# EAGLE schematic Power-Supply (EAGLE 9.6.2)
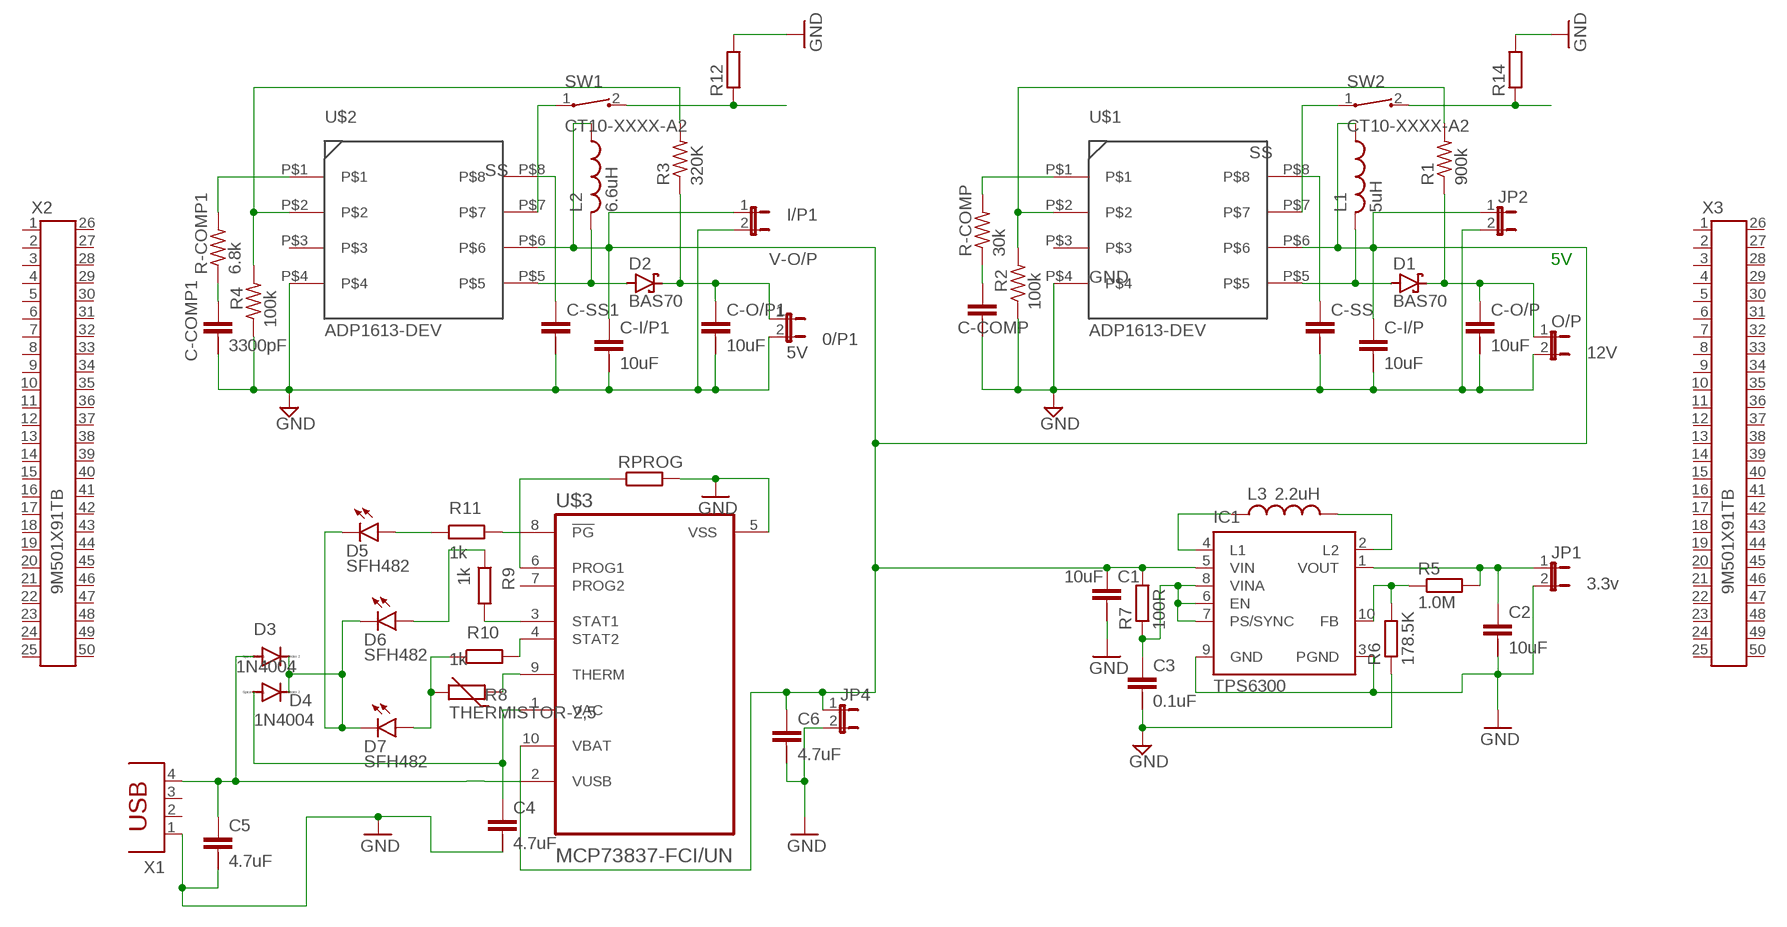
[diagram p0: schematic, sheet 1]

## Parts
0/P1  5V  JP1E  [JP1]
C1  10uF  C-2.5-5/2  [C2.5/5-2]
C2  10uF  C-2.5-5/2  [C2.5/5-2]
C3  0.1uF  C-2.5-5/2  [C2.5/5-2]
C4  4.7uF  C-2.5-5/2  [C2.5/5-2]
C5  4.7uF  C-2.5-5/2  [C2.5/5-2]
C6  4.7uF  C-2.5-5/2  [C2.5/5-2]
C-COMP  C-2.5-5/2  [C2.5/5-2]
C-COMP1  3300pF  C-2.5-5/2  [C2.5/5-2]
C-I/P  10uF  C-2.5-5/2  [C2.5/5-2]
C-I/P1  10uF  C-2.5-5/2  [C2.5/5-2]
C-O/P  10uF  C-2.5-5/2  [C2.5/5-2]
C-O/P1  10uF  C-2.5-5/2  [C2.5/5-2]
C-SS  C-2.5-5/2  [C2.5/5-2]
C-SS1  C-2.5-5/2  [C2.5/5-2]
D1  BAS70  [SOT23]
D2  BAS70  [SOT23]
D3  1N4004  [DO41-10]
D4  1N4004  [DO41-10]
D5  SFH482  [SFH482]
D6  SFH482  [SFH482]
D7  SFH482  [SFH482]
I/P1  3.3V  JP1E  [JP1]
IC1  TPS6300  [DRC-S-PVSON-N10]
JP1  3.3v  JP1E  [JP1]
JP2  JP1E  [JP1]
JP4  JP1E  [JP1]
L1  5uH  L-US0204/5  [0204/5]
L2  6.6uH  L-US0204/5  [0204/5]
L3  2.2uH  L-US0204/5  [0204/5]
O/P  12V  JP1E  [JP1]
R1  900k  R-US_0204/2V  [0204V]
R2  100k  R-US_0204/2V  [0204V]
R3  320K  R-US_0204/2V  [0204V]
R4  100k  R-US_0204/2V  [0204V]
R5  1.0M  R-EU_0204/5  [0204/5]
R6  178.5K  R-EU_0204/5  [0204/5]
R7  100R  R-EU_0204/5  [0204/5]
R8  THERMISTOR-2,5  [RS-2,5]
R9  1k  R  (no package)
R10  1k  R  (no package)
R11  1k  R  (no package)
R12  R-EU_0204/2V  [0204V]
R14  R-EU_0204/2V  [0204V]
R-COMP  30k  R-US_0204/2V  [0204V]
R-COMP1  6.8k  R-US_0204/2V  [0204V]
RPROG  R-EU_0204/5  [0204/5]
SW1  CT10-XXXX-A2  [CT10-XXXX-A2]
SW2  CT10-XXXX-A2  [CT10-XXXX-A2]
U$1  ADP1613-DEV  [ADP1613-FOOTPRINT]
U$2  ADP1613-DEV  [ADP1613-FOOTPRINT]
U$3  MCP73837-FCI/UN  [SOP50P490X110-10N]
X1  PN87520  [PN87520]
X2  9M501X91TB  [9M501X91]
X3  9M501X91TB  [9M501X91]

## Nets
GND: 0/P1.2 C1.2 C3.2 C4.2 C5.2 C6.2 C-COMP1.2 C-COMP.2 C-I/P1.2 C-I/P.2 C-O/P1.2 C-O/P.2 C-SS1.2 C-SS.2 I/P1.2 JP2.2 JP4.2 O/P.2 R2.1 R4.1 R6.1 R12.2 R14.2 RPROG.2 U$1.P$4 U$2.P$4 U$3.5(VSS) X1.1
N$1: D1.1(A) L1.2 U$1.P$5
N$2: SW1.1 U$2.P$7
N$3: C1.1 C6.1 C-I/P1.1 C-I/P.1 I/P1.1 IC1.5(VIN) JP2.1 JP4.1 L1.1 L2.1 R7.2 U$1.P$6 U$2.P$6 U$3.10(VBAT)
N$4: C-COMP.1 R-COMP.1
N$5: R-COMP1.2 U$2.P$1
N$6: R-COMP.2 U$1.P$1
N$7: IC1.4(L1) L3.1
N$8: C-COMP1.1 R-COMP1.1
N$9: IC1.2(L2) L3.2
N$10: D2.1(A) L2.2 U$2.P$5
N$11: C2.1 IC1.1(VOUT) JP1.1 R5.2
N$12: IC1.10(FB) R5.1 R6.2
N$13: R12.1 SW1.2
N$14: C3.1 IC1.6(EN) IC1.7(PS/SYNC) IC1.8(VINA) R7.1
N$15: SW2.1 U$1.P$7
N$16: R9.2 U$3.3(STAT1)
N$17: R10.2 U$3.4(STAT2)
N$18: R11.2 U$3.8(!PG)
N$19: D5.A R11.1
N$20: D3.C D4.C D5.K(C) D6.K(C) D7.K(C)
N$21: D6.A R9.1
N$22: D7.A R8.2 R10.1
N$23: C5.1 D3.A U$3.2(VUSB) X1.4
N$24: RPROG.1 U$3.6(PROG1)
N$25: C4.1 D4.A U$3.1(VAC)
N$26: R8.1 U$3.9(THERM)
N$27: R14.1 SW2.2
N$28: C2.2 IC1.3(PGND) IC1.9(GND) JP1.2 ; supply symbol labelled GND
SS: C-SS1.1 C-SS.1 U$1.P$8 U$2.P$8
V-I/P: R3.2 R4.2 U$2.P$2
V-O/P: 0/P1.1 C-O/P1.1 D2.3(C) R3.1
VIN: R1.2 R2.2 U$1.P$2
VOP: C-O/P.1 D1.3(C) O/P.1 R1.1
Unconnected: C1.3 C2.3 C3.3 C4.3 C5.3 C6.3 C-COMP1.3 C-COMP.3 C-I/P1.3 C-I/P.3 C-O/P1.3 C-O/P.3 C-SS1.3 C-SS.3 IC1.TH U$1.P$3 U$2.P$3 U$3.7(PROG2) X1.2 X1.3 X2.1 X2.2 X2.3 X2.4 X2.5 X2.6 X2.7 X2.8 X2.9 X2.10 X2.11 X2.12 X2.13 X2.14 X2.15 X2.16 X2.17 X2.18 X2.19 X2.20 X2.21 X2.22 X2.23 X2.24 X2.25 X2.26 X2.27 X2.28 X2.29 X2.30 X2.31 X2.32 X2.33 X2.34 X2.35 X2.36 X2.37 X2.38 X2.39 X2.40 X2.41 X2.42 X2.43 X2.44 X2.45 X2.46 X2.47 X2.48 X2.49 X2.50 X3.1 X3.2 X3.3 X3.4 X3.5 X3.6 X3.7 X3.8 X3.9 X3.10 X3.11 X3.12 X3.13 X3.14 X3.15 X3.16 X3.17 X3.18 X3.19 X3.20 X3.21 X3.22 X3.23 X3.24 X3.25 X3.26 X3.27 X3.28 X3.29 X3.30 X3.31 X3.32 X3.33 X3.34 X3.35 X3.36 X3.37 X3.38 X3.39 X3.40 X3.41 X3.42 X3.43 X3.44 X3.45 X3.46 X3.47 X3.48 X3.49 X3.50

## Notes on the sheet
- 5V

## Library data of the parts
0/P1 I/P1 JP1 JP2 JP4 O/P = jumper:JP1E: JUMPER
C1-C6 C-COMP C-COMP1 C-I/P C-I/P1 C-O/P C-O/P1 C-SS C-SS1 = capacitor-wima:C-: CAPACITOR for alternative placement naming: default grid - extended grid/package width
D1 D2 = diode:BAS70: Silicon Schottky Diodes General-purpose diode for high-speed switching
D3 D4 = diode:1N4004: DIODE general purpose rectifier, 1 A
D5-D7 = led:SFH482: IR LED infrared emitting diode, Infineon
IC1 = texas:TPS6300*: HIGH EFFICIENT SINGLE INDUCTOR BUCK-BOOST CONVERTER WITH 1.8-A SWITCHES Source: http://focus.ti.com/lit/ds/symlink/tps63001.pdf; MPN: TPS63000DRCTG4; OC_FARNELL: 1511852; OC_NEWARK: 59M7217
L1-L3 = rcl:L-US: INDUCTOR, American symbol; SPICEPREFIX: L
R1-R4 R-COMP R-COMP1 = rcl:R-US_: RESISTOR, American symbol; SPICEPREFIX: R
R5-R7 R12 R14 RPROG = rcl:R-EU_: RESISTOR, European symbol; SPICEPREFIX: R
R8 = varistor:THERMISTOR: THERMISTOR
R9-R11 = ngspice-simulation:R: RESISTOR
SW1 SW2 = switch-coto:CT10-XXXX-: CT10 Series Molded Switch Source: www.cotorelay.com .. Coto_Technology__CT10-1530-G1.pdf
U$1 U$2 = ADP1613-DEV:ADP1613-DEV
U$3 = MCP73837-FCI_UN:MCP73837-FCI/UN: Check prices <https://pricing.snapeda.com/search/part/MCP73837-FCI/UN/?ref=eda>; AVAILABILITY: Warning; DESCRIPTION: Charger IC Lithium Ion/Polymer 10-MSOP; MF: Microchip; MP: MCP73837-FCI/UN; PACKAGE: MSOP-10 Microchip; PRICE: None; PURCHASE-URL: https://pricing.snapeda.com/search/part/MCP73837-FCI/UN/?ref=eda
X1 = con-berg:PN87520: BERG USB connector; OC_FARNELL: unknown; OC_NEWARK: unknown
X2 X3 = con-3m:9M501X91TB: CONNECTOR PCMCIA-CompactFlash; OC_FARNELL: unknown; OC_NEWARK: unknown